# EAGLE design plumxsodrodd (EAGLE 9.6.2)
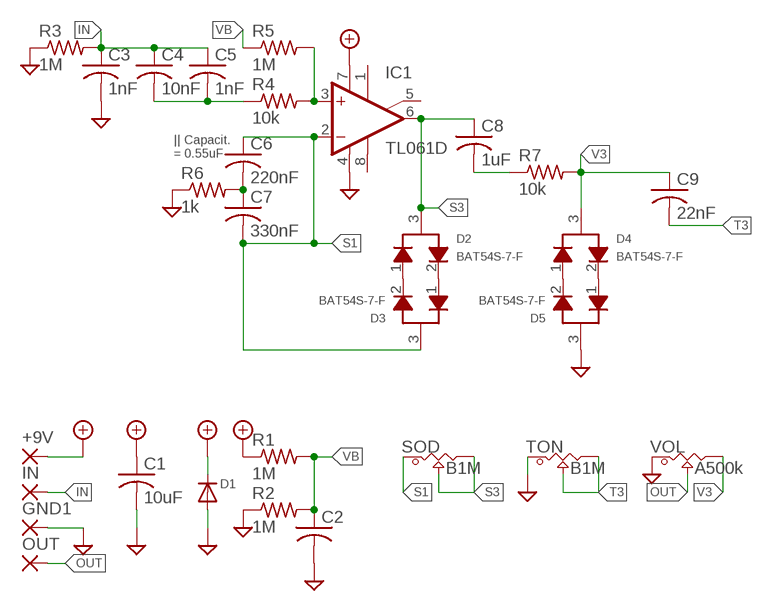
[diagram p0: schematic, sheet 1]

## Parts
+9V  SMD2  [SMD1,27-2,54]
C1  10uF  C-USC1206  [C1206]
C2  C-USC0603  [C0603]
C3  1nF  C-USC0603  [C0603]
C4  10nF  C-USC0603  [C0603]
C5  1nF  C-USC0603  [C0603]
C6  220nF  C-USC0603  [C0603]
C7  330nF  C-USC0603  [C0603]
C8  1uF  C-USC0603  [C0603]
C9  22nF  C-USC0603  [C0603]
D1  DIODESOD-123  [SOD-123]
D2  BAT54S-7-F  [SOT23-3]
D3  BAT54S-7-F  [SOT23-3]
D4  BAT54S-7-F  [SOT23-3]
D5  BAT54S-7-F  [SOT23-3]
GND1  SMD2  [SMD1,27-2,54]
IC1  TL061D  [SO08]
IN  SMD2  [SMD1,27-2,54]
OUT  SMD2  [SMD1,27-2,54]
R1  1M  R-US_R0603  [R0603]
R2  1M  R-US_R0603  [R0603]
R3  1M  R-US_R0603  [R0603]
R4  10k  R-US_R0603  [R0603]
R5  1M  R-US_R0603  [R0603]
R6  1k  R-US_R0603  [R0603]
R7  10k  R-US_R0603  [R0603]
SOD  B1M  POT_9MM_SMD  [POT_9MM_SMD]
TON  B1M  POT_9MM_SMD  [POT_9MM_SMD]
VOL  A500k  POT_9MM_SMD  [POT_9MM_SMD]

## Nets
+9V: +9V.1(P) C1.1 D1.C IC1.7(V+) R1.1
GND: C1.2 C2.2 C3.2 D1.A D5.3 GND1.1(P) IC1.4(V-) R2.1 R3.1 R6.1 TON.1 VOL.1
IN: C3.1 C4.1 C5.1 IN.1(P) R3.2
N$1: C4.2 C5.2 R4.1
N$2: IC1.3(+IN) R4.2 R5.2
N$3: D2.2 D3.1
N$4: C6.2 C7.1 R6.2
N$5: D2.1 D3.2
N$7: C8.2 R7.1
N$8: D4.2 D5.1
N$9: D4.1 D5.2
OUT: OUT.1(P) VOL.2
S1: C6.1 C7.2 D3.3 IC1.2(-IN) SOD.1
S3: C8.1 D2.3 IC1.6(OUT) SOD.2 SOD.3
T3: C9.2 TON.2 TON.3
V3: C9.1 D4.3 R7.2 VOL.3
VB: C2.1 R1.2 R2.2 R5.1
Unconnected: IC1.1(ON1) IC1.5(ON2) IC1.8(OPT)

## Notes on the sheet
- || Capacit.
  = 0.55uF

## Library data of the parts
+9V GND1 IN OUT = wirepad:SMD2: SMD PAD
C1-C9 = adafruit:C-US: CAPACITOR, American symbol
D1 = adafruit:DIODE: Diode SMADIODE - SMA Surface Mount Package 20V 1A Schottky Diode Digikey: 641-1014-6-ND DO-1N4148 - Through Hole Small Current Diode SOD-123 20V 1 A (.5mV Vf) Schottky Diode - Digikey: MBRX120TPMSCT-ND SOD-323 10V 570mA (.38mV Vf, 3ns) Schottky Diode - Digikey: ZLLS410CT-ND SOD-523 30V 30mA Schottky Diode (RB751S-40TE61) - Digikey: RB751S-40TE61CT-ND SOT23-R/W - SOT23 Package (R = Solder Paste/Reflow Ovens, W = Hand-Soldering) BAT54Film 40V 300mA - Digikey: 497-7162-1-ND
D2-D5 = Diodes:BAT54S-7-F: DIODE ARRAY SCHOTTKY 30V SOT23-3 Manufacturer's datasheet <https://www.diodes.com/assets/Datasheets/ds11005.pdf>; CREATED_BY: PCBLayout.com; DIGIKEY_PART_NUMBER: BAT54S-FDITR-ND; MANUFACTURER: Diodes Incorporated; MPN: BAT54S-7-F; PACKAGE: SOT-23
IC1 = linear:TL061: OP AMP
R1-R7 = adafruit:R-US_: RESISTOR, American symbol
SOD TON VOL = Mech_BO_CE_SW:POT_9MM_SMD

## Board
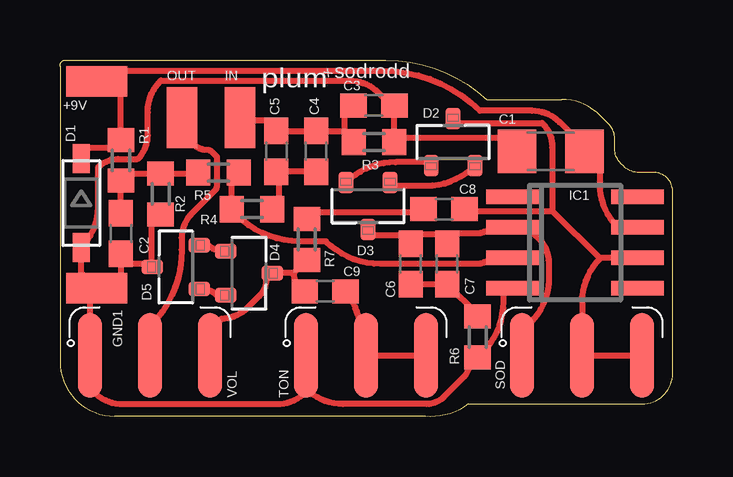
[diagram p1: board, top side]

Size 25.53 x 14.88 mm. Coordinates in mm from the lower left corner, seen from the top.
Outline: 0,14.62 0,2.3 arc90 2.29,0.02 15.21,0.02 arc45 17.02,0.52 24.26,0.52 arc90 25.53,1.79 25.53,9.41 arc90 24.77,10.18 24.13,10.18 arc-45 23.48,10.45 23.37,10.56 arc-45 23.11,11.17 23.11,11.6 arc45 22.86,12.21 22.51,12.55 arc45 20.9,13.22 17.78,13.22 arc43 13.58,14.88 0.25,14.88 arc90 0,14.62
Copper layers (1*16): Top 0.035mm / dielectric 1.5mm / Bottom 0.035mm
Design rules "default *": minimum track width 6mil, minimum drill 0.35mm, track to track 6mil, track to pad 6mil, pad to pad 6mil, via to via 6mil, smd to smd 6mil, copper to edge 10mil, drill to drill 6mil, minimum pad ring 10mil, minimum via ring 8mil, stop-mask expansion 4mil, vias tented up to drill 0mil, thermal gap 10mil

### Footprints (pad centres in the part's own frame; a part is rotated, then mirrored left to right if it is on the bottom)
SMD1,27-2,54 = smd 1.27 x 2.54: 1 0,0
C1206 = smd 1.6 x 1.8: 1 -1.4,0; 2 1.4,0
C0603 = smd 1.1 x 1: 1 -0.85,0; 2 0.85,0
SOD-123 = smd 1.2 x 0.7: A 1.85,0; C -1.85,0
SOT23-3 = smd 0.63 x 0.9: 1 -0.915,-0.975; 2 0.915,-0.975; 3 0,0.975
SO08 = smd 0.6 x 2.2: 1 -1.905,-2.6; 2 -0.635,-2.6; 3 0.635,-2.6; 4 1.905,-2.6; 5 1.905,2.6; 6 0.635,2.6; 7 -0.635,2.6; 8 -1.905,2.6
R0603 = smd 1 x 1.1: 1 -0.85,0; 2 0.85,0
POT_9MM_SMD = smd 0.991 x 3.505: 1 -2.5,0; 2 0,0; 3 2.5,0

### Placement (x,y rotation side)
+9V  1.52,13.99 90 top
C1  20.45,11.07 180 top
C2  2.54,7.64 270 top
C3  13.08,12.97 0 top
C4  10.67,11.07 270 top
C5  9.02,11.07 270 top
C6  14.61,6.37 270 top
C7  16.13,6.37 90 top
C8  16,8.65 180 top
C9  11.05,5.22 0 top
D1  0.89,8.91 270 top
D2  16.38,11.45 0 top
D3  12.83,8.78 180 top
D4  7.87,5.99 270 top
D5  4.83,6.24 90 top
GND1  1.52,5.35 90 top
IC1  21.46,7.26 270 top
IN  7.49,12.46 180 top
OUT  5.08,12.46 180 top
R1  2.54,10.68 270 top
R2  4.19,9.29 90 top
R3  13.08,11.45 180 top
R4  8,8.65 180 top
R5  6.6,10.18 0 top
R6  17.4,3.32 90 top
R7  10.29,7.38 270 top
SOD  21.75,2.56 0 top
TON  12.75,2.56 0 top
VOL  3.75,2.56 0 top

### Tracks (layer width: path | path; a pad name or v marks a point on that pad's centre or on a via)
+9V
  Top 0.254: IC1.7 23.24,7.89 23.23,7.91 arc-45 22.48,9.7 22.48,10.43 C1.1 21.85,11.25 20.82,12.28 arc45 19.67,12.75 17.49,12.75 arc45 13.47,14.42 2.64,14.42 1.86,13.65 +9V.1 2.03,13.99 2.54,13.48 R1.1 2.2,11.19 1.07,11.19 0.89,11.01 D1.C
GND
  Top 0.254: 1.4,1.03 1.4,2.41 VOL.1 1.25,5.08 1.46,5.29 | 1.4,1.03 | 1.4,1.03 arc45 2.62,0.52 9.03,0.52 arc45 10.25,1.03 10.29,1.03 10.25,1.07 10.25,1.16 | TON.1 10.25,1.16 | 1.46,5.29 GND1.1 0.89,5.99 D1.A arc45 1.58,8.73 1.58,10.4 arc-45 2.41,10.74 3.24,10.74 arc45 3.66,11.74 3.66,12.7 arc-45 4.2,14.01 12.09,14.01 arc-45 13.24,13.54 13.8,12.97 C3.2 13.93,11.57 | C2.2 2.54,6.37 | 2.54,6.37 2.54,5.48 2.35,5.29 1.46,5.29 | R3.1 13.93,11.57 | C1.2 18.5,11.61 13.96,11.61 13.93,11.57 | D5.3 3.72,6.37 | 3.72,6.37 2.54,6.37 | R2.1 3.81,8.06 3.81,6.45 3.72,6.37 | 10.25,1.16 arc45 11.78,0.52 15.28,0.52 arc45 15.99,0.82 16.85,1.67 arc45 17.02,2.09 R6.1 17.61,2.68 arc45 18.48,4.78 18.48,5.1 18.74,5.35 IC1.4
IN
  Top 0.254: IN.1 7.62,12.34 8.6,12.34 C5.1 C4.1 11.76,11.92 | 11.76,11.92 11.85,11.92 11.85,12.59 C3.1 | R3.2 11.76,11.92
N$1
  Top 0.254: C4.2 C5.2 9.11,10.13 9.11,8.91 R4.1
N$2
  Top 0.254: R5.2 7.15,9.87 R4.2 7.37,8.44 7.37,8.4 arc45 9.99,7.31 11.08,7.31 arc45 13.36,6.37 17.36,6.37 arc45 17.97,6.62 IC1.3
N$3
  Top 0.254: D3.1 13.87,9.63 15.26,9.63 arc45 D2.2
N$4
  Top 0.254: C6.2 C7.1 17.4,4.26 R6.2
N$5
  Top 0.254: D3.2 arc-45 13.98,10.61 15.33,10.61 D2.1
N$7
  Top 0.254: R7.1 10.59,8.53 15.03,8.53 C8.2
N$8
  Top 0.254: D5.1 5.91,5.32 arc-45 6.52,5.07 D4.2
N$9
  Top 0.254: D5.2 6.18,7.15 arc45 6.79,6.9 D4.1
OUT
  Top 0.254: VOL.2 3.75,3.77 arc45 5.07,6.96 5.07,7.47 arc-45 5.48,8.46 6.47,9.45 arc45 6.53,9.6 6.53,10.84 6.35,11.03 arc45 6.09,11.13 arc-45 5.59,11.34 5.59,11.95 OUT.1
S1
  Top 0.254: SOD.1 19.25,3.57 19.62,3.95 arc45 20.37,5.74 20.37,6.38 arc90 IC1.2 17.97,7.89 arc-45 17.36,7.64 16.51,7.64 16.51,7.6 C7.2 15.75,7.6 14.99,7.6 C6.1 14.27,7.55 12.95,7.55 12.83,7.68 D3.3
S3
  Top 0.254: IC1.6 22.52,6.62 22.5,6.6 | 22.5,6.6 arc45 21.75,4.79 SOD.2 SOD.3 | 20.52,8.58 20.51,8.59 20.51,11.24 arc45 20.09,12.24 16.38,12.24 D2.3 | 20.52,8.58 22.5,6.6 | C8.1 17.07,8.65 17.14,8.58 20.52,8.58
T3
  Top 0.254: TON.3 TON.2 12.5,2.81 12.5,3.69 arc45 11.9,5.14 C9.2
V3
  Top 0.254: VOL.3 6.25,3.6 6.73,4.08 arc45 7.8,4.52 8.3,5.03 arc45 8.6,5.73 D4.3 9.74,5.99 | R7.2 9.74,5.99 | C9.1 9.95,5.47 arc-45 9.74,5.99
VB
  Top 0.254: C2.1 R1.2 2.84,10.14 R2.2 5.71,10.14 R5.1

### Text on the board
tPlace: plum | x | sodrodd